# Altium project iceWerx_dev_carrier.PrjPcb
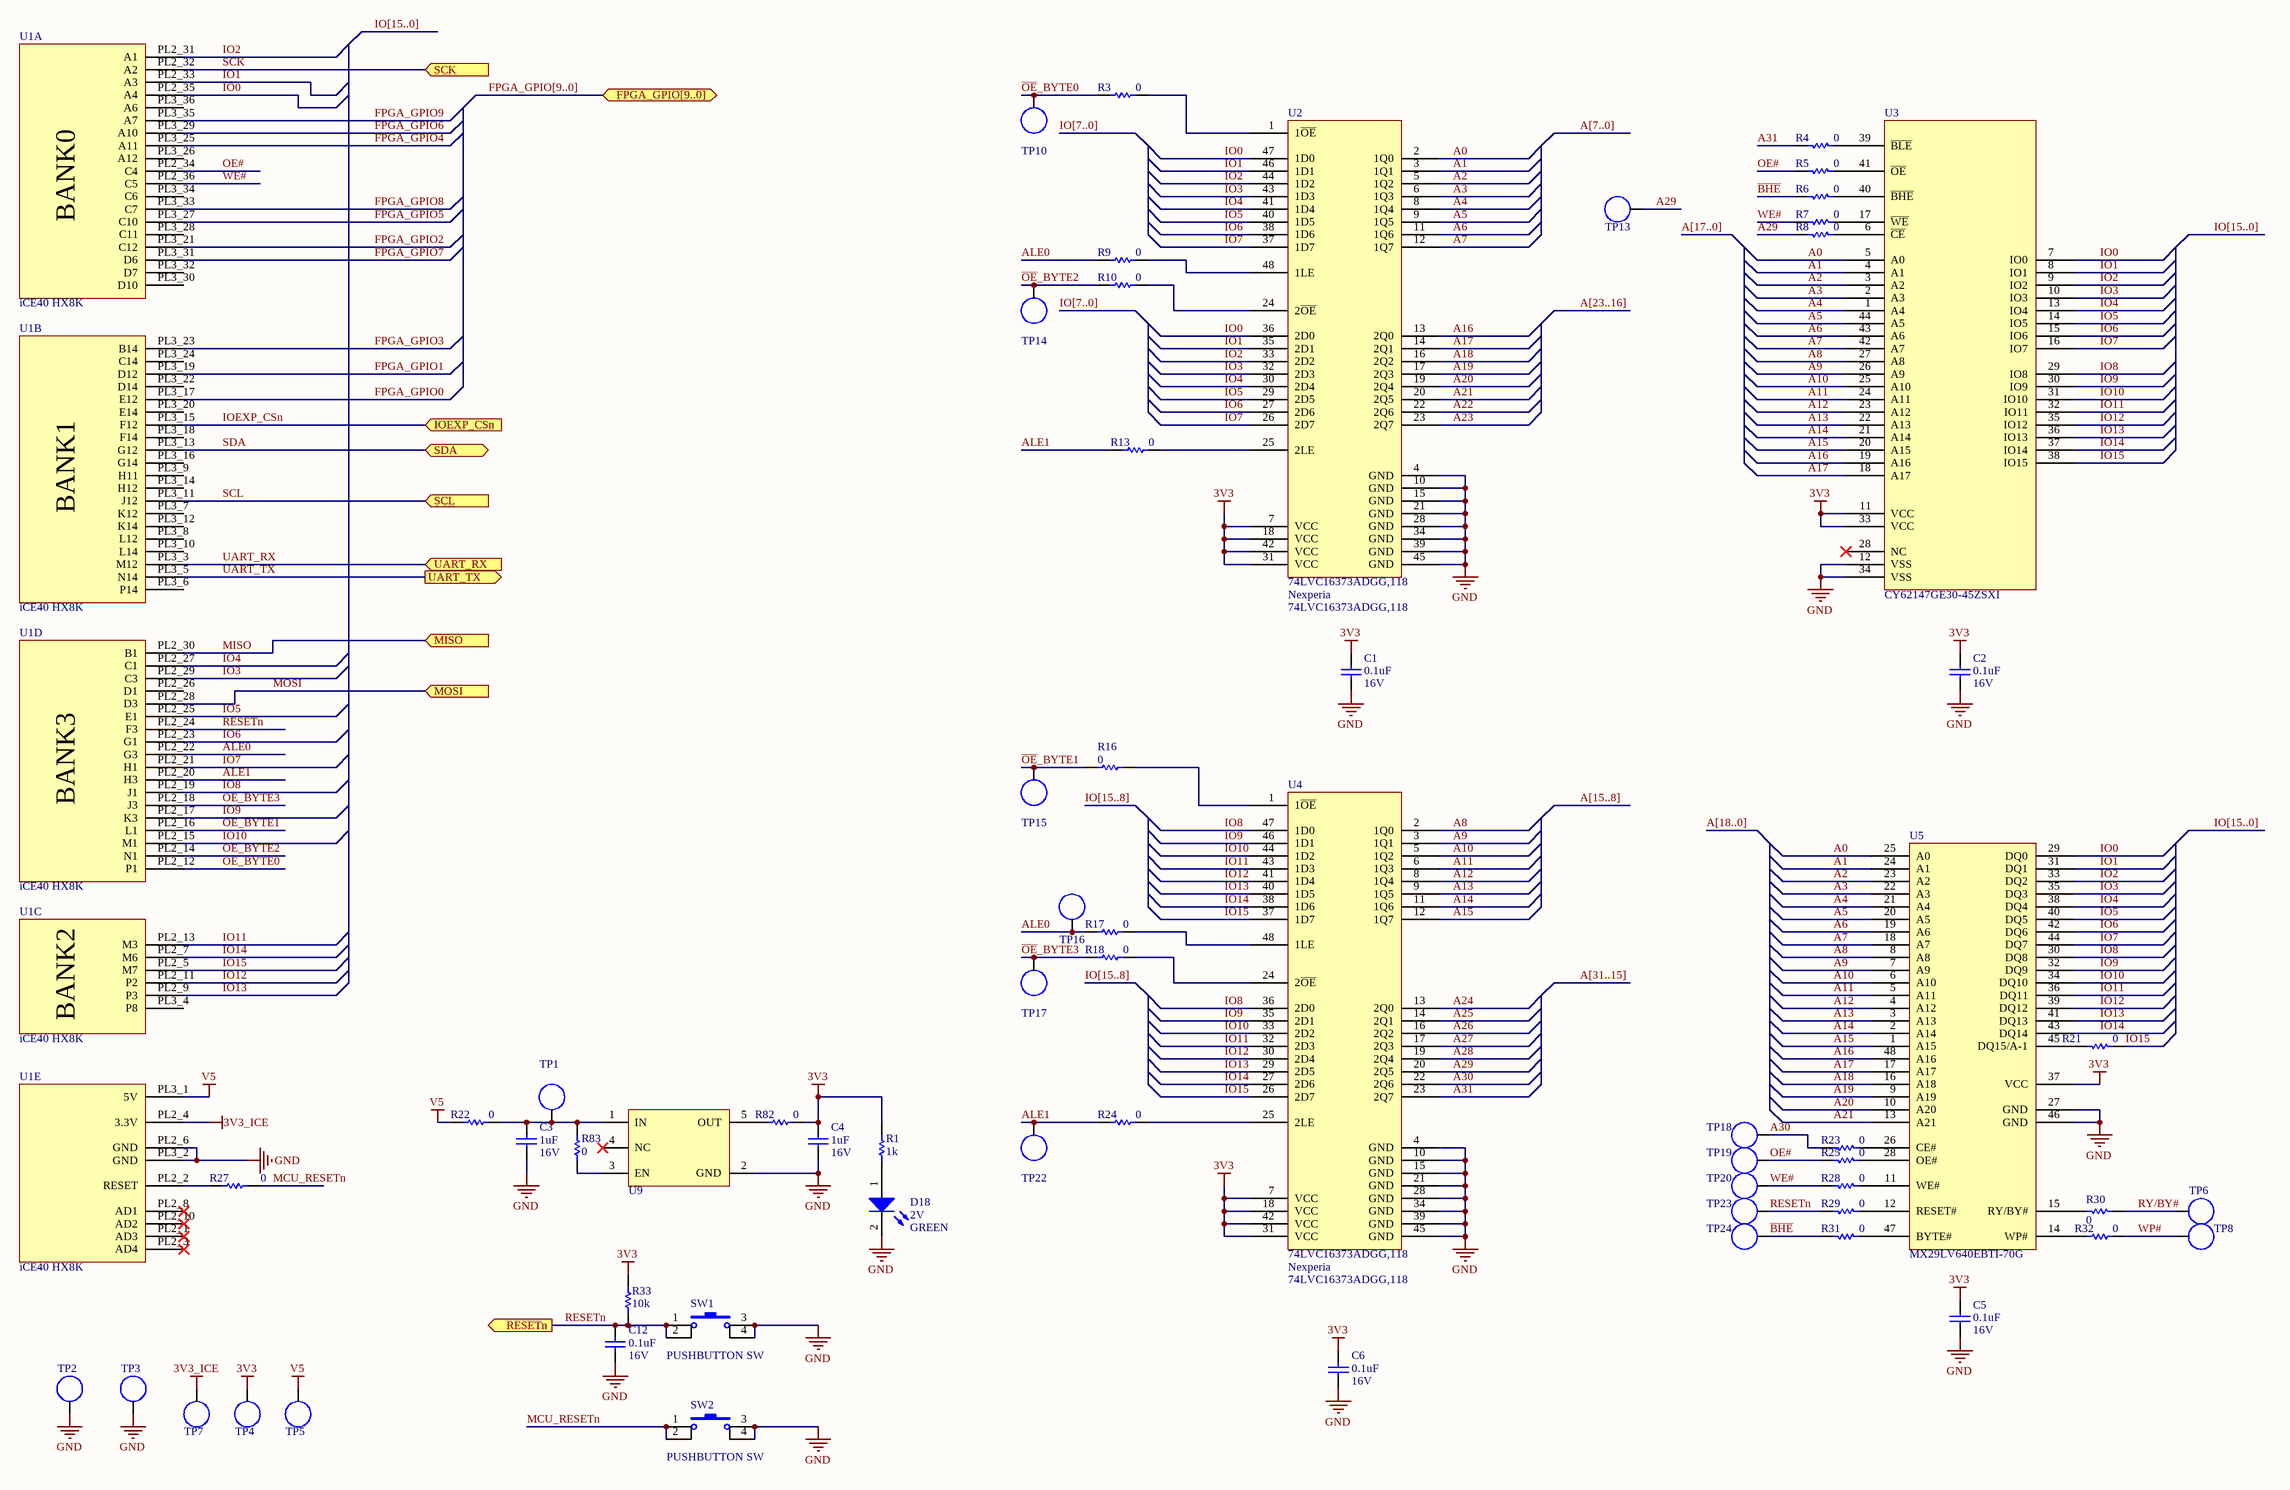
[diagram p0: icewerks.SchDoc]
2 sheets, 142 parts. Net scope: flat (ports and power ports of the same name join across sheets).
Board file: iceWerx_dev_carrier.PcbDoc
Sheets:
  icewerks.SchDoc
  peripherals.SchDoc

## Sheet icewerks.SchDoc
size C

### Parts
C1  Voltage: 16V  Capacitance: 0.1uF  [0805]  (hidden comment: Cap_NP)
C2  Voltage: 16V  Capacitance: 0.1uF  [0805]  (hidden comment: Cap_NP)
C3  Voltage: 16V  Capacitance: 1uF  [0805]  (hidden comment: Cap_NP)
C4  Voltage: 16V  Capacitance: 1uF  [0805]  (hidden comment: Cap_NP)
C5  Voltage: 16V  Capacitance: 0.1uF  [0805]  (hidden comment: Cap_NP)
C6  Voltage: 16V  Capacitance: 0.1uF  [0805]  (hidden comment: Cap_NP)
C12  Voltage: 16V  Capacitance: 0.1uF  [0805]  (hidden comment: Cap_NP)
D18  Vf: 2V  Color: GREEN  [HSMG-C170]  (hidden comment: LED)
R1  Resistance: 1k  [0805]  (hidden comment: Res)
R3  Resistance: 0  [0805]  (hidden comment: Res)
R4  Resistance: 0  [0805]  (hidden comment: Res)
R5  Resistance: 0  [0805]  (hidden comment: Res)
R6  Resistance: 0  [0805]  (hidden comment: Res)
R7  Resistance: 0  [0805]  (hidden comment: Res)
R8  Resistance: 0  [0805]  (hidden comment: Res)
R9  Resistance: 0  [0805]  (hidden comment: Res)
R10  Resistance: 0  [0805]  (hidden comment: Res)
R13  Resistance: 0  [0805]  (hidden comment: Res)
R16  Resistance: 0  [0805]  (hidden comment: Res)
R17  Resistance: 0  [0805]  (hidden comment: Res)
R18  Resistance: 0  [0805]  (hidden comment: Res)
R21  Resistance: 0  [0805]  (hidden comment: Res)
R22  Resistance: 0  [0805]  (hidden comment: Res)
R23  Resistance: 0  [0805]  (hidden comment: Res)
R24  Resistance: 0  [0805]  (hidden comment: Res)
R25  Resistance: 0  [0805]  (hidden comment: Res)
R27  Resistance: 0  [0805]  (hidden comment: Res)
R28  Resistance: 0  [0805]  (hidden comment: Res)
R29  Resistance: 0  [0805]  (hidden comment: Res)
R30  Resistance: 0  [0805]  (hidden comment: Res)
R31  Resistance: 0  [0805]  (hidden comment: Res)
R32  Resistance: 0  [0805]  (hidden comment: Res)
R33  Resistance: 10k  [0805]  (hidden comment: Res)
R82  Resistance: 0  [0805]  (hidden comment: Res)
R83  Resistance: 0  [0805]  (hidden comment: Res)
SW1  PUSHBUTTON SW  [XKB TS-1187A]
SW2  PUSHBUTTON SW  [XKB TS-1187A]
TP1  TP  [KEYSTONE_5012]  (value not drawn)
TP2  TP  [KEYSTONE_5012]  (value not drawn)
TP3  TP  [KEYSTONE_5012]  (value not drawn)
TP4  TP  [KEYSTONE_5012]  (value not drawn)
TP5  TP  [KEYSTONE_5012]  (value not drawn)
TP6  TP  [KEYSTONE_5012]  (value not drawn)
TP7  TP  [KEYSTONE_5012]  (value not drawn)
TP8  TP  [KEYSTONE_5012]  (value not drawn)
TP10  TP  [KEYSTONE_5012]  (value not drawn)
TP13  TP  [KEYSTONE_5012]  (value not drawn)
TP14  TP  [KEYSTONE_5012]  (value not drawn)
TP15  TP  [KEYSTONE_5012]  (value not drawn)
TP16  TP  [KEYSTONE_5012]  (value not drawn)
TP17  TP  [KEYSTONE_5012]  (value not drawn)
TP18  TP  [KEYSTONE_5012]  (value not drawn)
TP19  TP  [KEYSTONE_5012]  (value not drawn)
TP20  TP  [KEYSTONE_5012]  (value not drawn)
TP22  TP  [KEYSTONE_5012]  (value not drawn)
TP23  TP  [KEYSTONE_5012]  (value not drawn)
TP24  TP  [KEYSTONE_5012]  (value not drawn)
U1  iCE40 HX8K  [iCE40 HX8K FPGA MODULE]  (parts A,B,C,D,E of 5)
U2  74LVC16373ADGG,118  Manufacturer: Nexperia  [NEXPERIA TSSOP-48 (SOT362-1)]
U3  CY62147GE30-45ZSXI  [CYPRESS Z44 44-TSOP II]
U4  74LVC16373ADGG,118  Manufacturer: Nexperia  [NEXPERIA TSSOP-48 (SOT362-1)]
U5  MX29LV640EBTI-70G
U9  TLV73333PDBVR  [TI DBV0005A (SOT23-5)]  (value not drawn)

### Ports
FPGA_GPIO[9..0] (bidir), IOEXP_CSn (in), MISO (in), MOSI (in), RESETn (out), SCK (in), SCL (in), SDA (bidir), UART_RX (in), UART_TX (out)

### Nets
3V3: C1.2 C2.2 C4.2 C5.2 C6.2 R1.2 R33.2 R82.2 TP4.1 U2.7(VCC) U2.18(VCC) U2.31(VCC) U2.42(VCC) U3.11(VCC) U3.33(VCC) U4.7(VCC) U4.18(VCC) U4.31(VCC) U4.42(VCC) U5.37(VCC)
3V3_ICE: TP7.1 U1.PL2_4(3.3V)
GND: C1.1 C2.1 C3.1 C4.1 C5.1 C6.1 C12.1 D18.2(K) SW1.3 SW1.4 SW2.3 SW2.4 TP2.1 TP3.1 U1.PL2_6(GND) U1.PL3_2(GND) U2.4(GND) U2.10(GND) U2.15(GND) U2.21(GND) U2.28(GND) U2.34(GND) U2.39(GND) U2.45(GND) U3.12(VSS) U3.34(VSS) U4.4(GND) U4.10(GND) U4.15(GND) U4.21(GND) U4.28(GND) U4.34(GND) U4.39(GND) U4.45(GND) U5.27(GND) U5.46(GND) U9.2(GND)
V5: R22.1 TP5.1 U1.PL3_1(5V)
A0: U2.2(1Q0) U3.5(A0) U5.25(A0)
A1: U2.3(1Q1) U3.4(A1) U5.24(A1)
A2: U2.5(1Q2) U3.3(A2) U5.23(A2)
A3: U2.6(1Q3) U3.2(A3) U5.22(A3)
A4: U2.8(1Q4) U3.1(A4) U5.21(A4)
A5: U2.9(1Q5) U3.44(A5) U5.20(A5)
A6: U2.11(1Q6) U3.43(A6) U5.19(A6)
A7: U2.12(1Q7) U3.42(A7) U5.18(A7)
A8: U3.27(A8) U4.2(1Q0) U5.8(A8)
A9: U3.26(A9) U4.3(1Q1) U5.7(A9)
A10: U3.25(A10) U4.5(1Q2) U5.6(A10)
A11: U3.24(A11) U4.6(1Q3) U5.5(A11)
A12: U3.23(A12) U4.8(1Q4) U5.4(A12)
A13: U3.22(A13) U4.9(1Q5) U5.3(A13)
A14: U3.21(A14) U4.11(1Q6) U5.2(A14)
A15: U3.20(A15) U4.12(1Q7) U5.1(A15)
A16: U2.13(2Q0) U3.19(A16) U5.48(A16)
A17: U2.14(2Q1) U3.18(A17) U5.17(A17)
A18: U2.16(2Q2) U5.16(A18)
A19: U2.17(2Q3) U5.9(A19)
A20: U2.19(2Q4) U5.10(A20)
A21: U2.20(2Q5) U5.13(A21)
A22: U2.22(2Q6)
A23: U2.23(2Q7)
A24: U4.13(2Q0)
A25: U4.14(2Q1)
A26: U4.16(2Q2)
A27: U4.17(2Q3)
A28: U4.19(2Q4)
A29: R8.2 TP13.1 U4.20(2Q5)
A30: R23.2 TP18.1 U4.22(2Q6)
A31: R4.2 U4.23(2Q7)
ALE0: R9.1 R17.1 TP16.1 U1.PL2_22(G3)
ALE1: R13.1 R24.1 TP22.1 U1.PL2_20(H3)
~{BHE}: R6.2 R31.2 TP24.1
FPGA_GPIO0: U1.PL3_17(E12)
FPGA_GPIO1: U1.PL3_19(D12)
FPGA_GPIO2: U1.PL3_21(C12)
FPGA_GPIO3: U1.PL3_23(B14)
FPGA_GPIO4: U1.PL3_25(A11)
FPGA_GPIO5: U1.PL3_27(C10)
FPGA_GPIO6: U1.PL3_29(A10)
FPGA_GPIO7: U1.PL3_31(D6)
FPGA_GPIO8: U1.PL3_33(C7)
FPGA_GPIO9: U1.PL3_35(A7)
IO0: U1.PL2_35(A4) U2.36(2D0) U2.47(1D0) U3.7(IO0) U5.29(DQ0)
IO1: U1.PL2_33(A3) U2.35(2D1) U2.46(1D1) U3.8(IO1) U5.31(DQ1)
IO2: U1.PL2_31(A1) U2.33(2D2) U2.44(1D2) U3.9(IO2) U5.33(DQ2)
IO3: U1.PL2_29(C3) U2.32(2D3) U2.43(1D3) U3.10(IO3) U5.35(DQ3)
IO4: U1.PL2_27(C1) U2.30(2D4) U2.41(1D4) U3.13(IO4) U5.38(DQ4)
IO5: U1.PL2_25(E1) U2.29(2D5) U2.40(1D5) U3.14(IO5) U5.40(DQ5)
IO6: U1.PL2_23(G1) U2.27(2D6) U2.38(1D6) U3.15(IO6) U5.42(DQ6)
IO7: U1.PL2_21(H1) U2.26(2D7) U2.37(1D7) U3.16(IO7) U5.44(DQ7)
IO8: U1.PL2_19(J1) U3.29(IO8) U4.36(2D0) U4.47(1D0) U5.30(DQ8)
IO9: U1.PL2_17(K3) U3.30(IO9) U4.35(2D1) U4.46(1D1) U5.32(DQ9)
IO10: U1.PL2_15(M1) U3.31(IO10) U4.33(2D2) U4.44(1D2) U5.34(DQ10)
IO11: U1.PL2_13(M3) U3.32(IO11) U4.32(2D3) U4.43(1D3) U5.36(DQ11)
IO12: U1.PL2_11(P2) U3.35(IO12) U4.30(2D4) U4.41(1D4) U5.39(DQ12)
IO13: U1.PL2_9(P3) U3.36(IO13) U4.29(2D5) U4.40(1D5) U5.41(DQ13)
IO14: U1.PL2_7(M6) U3.37(IO14) U4.27(2D6) U4.38(1D6) U5.43(DQ14)
IO15: R21.1 U1.PL2_5(M7) U3.38(IO15) U4.26(2D7) U4.37(1D7)
IOEXP_CSn: U1.PL3_15(F12) ; port IOEXP_CSn
MCU_RESETn: R27.2 SW2.1 SW2.2
MISO: U1.PL2_30(B1) ; port MISO
MOSI: U1.PL2_28(D3) ; port MOSI
~{OE}_BYTE0: R3.1 TP10.1 U1.PL2_12(P1)
~{OE}_BYTE1: R16.1 TP15.1 U1.PL2_16(L1)
~{OE}_BYTE2: R10.1 TP14.1 U1.PL2_14(N1)
~{OE}_BYTE3: R18.1 TP17.1 U1.PL2_18(J3)
OE#: R5.2 R25.2 TP19.1 U1.PL2_34(C4)
RESETn: C12.2 R29.2 R33.1 SW1.1 SW1.2 TP23.1 U1.PL2_24(F3) ; port RESETn
RY/BY#: R30.1 TP6.1
SCK: U1.PL2_32(A2) ; port SCK
SCL: U1.PL3_11(J12) ; port SCL
SDA: U1.PL3_13(G12) ; port SDA
UART_RX: U1.PL3_3(M12) ; port UART_RX
UART_TX: U1.PL3_5(N14) ; port UART_TX
WE#: R7.2 R28.2 TP20.1 U1.PL2_36(C5)
WP#: R32.2 TP8.1
NetC3_2: C3.2 R22.2 R83.2 TP1.1 U9.1(IN)
NetD18_1: D18.1(A) R1.1
NetR3_2: R3.2 U2.1(1~{OE})
NetR4_1: R4.1 U3.39(~{BLE})
NetR5_1: R5.1 U3.41(~{OE})
NetR6_1: R6.1 U3.40(~{BHE})
NetR7_1: R7.1 U3.17(~{WE})
NetR8_1: R8.1 U3.6(~{CE})
NetR9_2: R9.2 U2.48(1LE)
NetR10_2: R10.2 U2.24(2~{OE})
NetR13_2: R13.2 U2.25(2LE)
NetR16_2: R16.2 U4.1(1~{OE})
NetR17_2: R17.2 U4.48(1LE)
NetR18_2: R18.2 U4.24(2~{OE})
NetR21_2: R21.2 U5.45(DQ15/A-1)
NetR23_1: R23.1 U5.26(CE#)
NetR24_2: R24.2 U4.25(2LE)
NetR25_1: R25.1 U5.28(OE#)
NetR27_1: R27.1 U1.PL2_2(RESET)
NetR28_1: R28.1 U5.11(WE#)
NetR29_1: R29.1 U5.12(RESET#)
NetR30_2: R30.2 U5.15(RY/BY#)
NetR31_1: R31.1 U5.47(BYTE#)
NetR32_1: R32.1 U5.14(WP#)
NetR82_1: R82.1 U9.5(OUT)
NetR83_1: R83.1 U9.3(EN)

Not connected (* = marked no-connect by the designer): U1 PL2_1(AD3)* PL2_3(AD4)* PL2_8(AD1)* PL2_10(AD2)* PL2_26(D1) PL3_4(P8) PL3_6(P14) PL3_7(K12) PL3_8(L12) PL3_9(H11) PL3_10(L14) PL3_12(K14) PL3_14(H12) PL3_16(G14) PL3_18(F14) PL3_20(E14) PL3_22(D14) PL3_24(C14) PL3_26(A12) PL3_28(C11) PL3_30(D10) PL3_32(D7) PL3_34(C6) PL3_36(A6); U3 28(NC)*; U9 4(NC)*

### Buses and harness runs
bus A[7..0]
bus A[15..8]
bus A[17..0]
bus A[18..0]
bus A[23..16]
bus A[31..15]
bus FPGA_GPIO[9..0] = port FPGA_GPIO[9..0]
bus IO[7..0]
bus IO[15..0]
bus IO[15..8]

### Notes on the sheet
- (in symbol iCE40 HX8K FPGA MODULE, part A) BANK0
- (in symbol iCE40 HX8K FPGA MODULE, part B) BANK1
- (in symbol iCE40 HX8K FPGA MODULE, part C) BANK2
- (in symbol iCE40 HX8K FPGA MODULE, part D) BANK3

### Library data of the parts
C1 C2 C5 C6 C12 = Cap_NP: Capacitor; Manufacturer PN: C0805C104M4VACTU; Manufacturer: KEMET; Tolerance: *
C3 C4 = Cap_NP: Capacitor; Manufacturer PN: EMK212BJ105MD-T; Manufacturer: Taiyo Yuden; Tolerance: *
D18 = LED: Manufacturer: Broadcom; Manufacturer PN: HSMG-C170
R1 = Res: Resistor; Manufacturer PN: RMCF0805JT1K00; Manufacturer: Stackpole Electronics Inc; Tolerance: 5%; Power Rating: 1/8W
R3-R10 R13 R16-R18 R21-R25 R27-R32 R82 R83 = Res: Resistor; Manufacturer PN: RMCF0805ZT0R00; Manufacturer: Stackpole Electronics Inc; Tolerance: Jumper; Power Rating: 1/10W
R33 = Res: Resistor; Manufacturer PN: RMCF0805JT10K0; Manufacturer: Stackpole Electronics Inc; Tolerance: 5%; Power Rating: 1/8W
SW1 SW2 = SWITCH_PB: Manufacturer PN: TS-1187A-C-E-B; Manufacturer: XKB
TP1-TP8 TP10 TP13-TP20 TP22-TP24 = TP: Manufacturer PN: 5015; Manufacturer: Keystone
U1 = iCE40 HX8K FPGA MODULE: Manufacturer: Samtec; Manufacturer PN: SQW-118-01-L-D
U2 U4 = 74LVC16373ADGG,118: D-Type Transparent Latch 2 Channel 8:8 IC Tri-State 48-TSSOP; Manufacturer PN: 74LVC16373ADGG,118
U3 = CY62147GE30-45ZSXI: SRAM - Asynchronous Memory IC 4Mb (256K x 16) Parallel 45ns 44-TSOP II; Manufacturer: Cypress; Manufacturer PN: CY62147GE30-45ZSXI
U5 = MX29LV640EBTI-70G: FLASH - NOR Memory IC 8Mb (1M x 8, 512K x 16) Parallel  70ns 48-TSOP; Manufacturer: Macronix; Manufacturer PN: MX29LV640EBTI-70G
U9 = TLV73333PDBVR: Manufacturer: Texas Instruments; Manufacturer PN: TLV73333PDBVR

## Sheet peripherals.SchDoc
size C
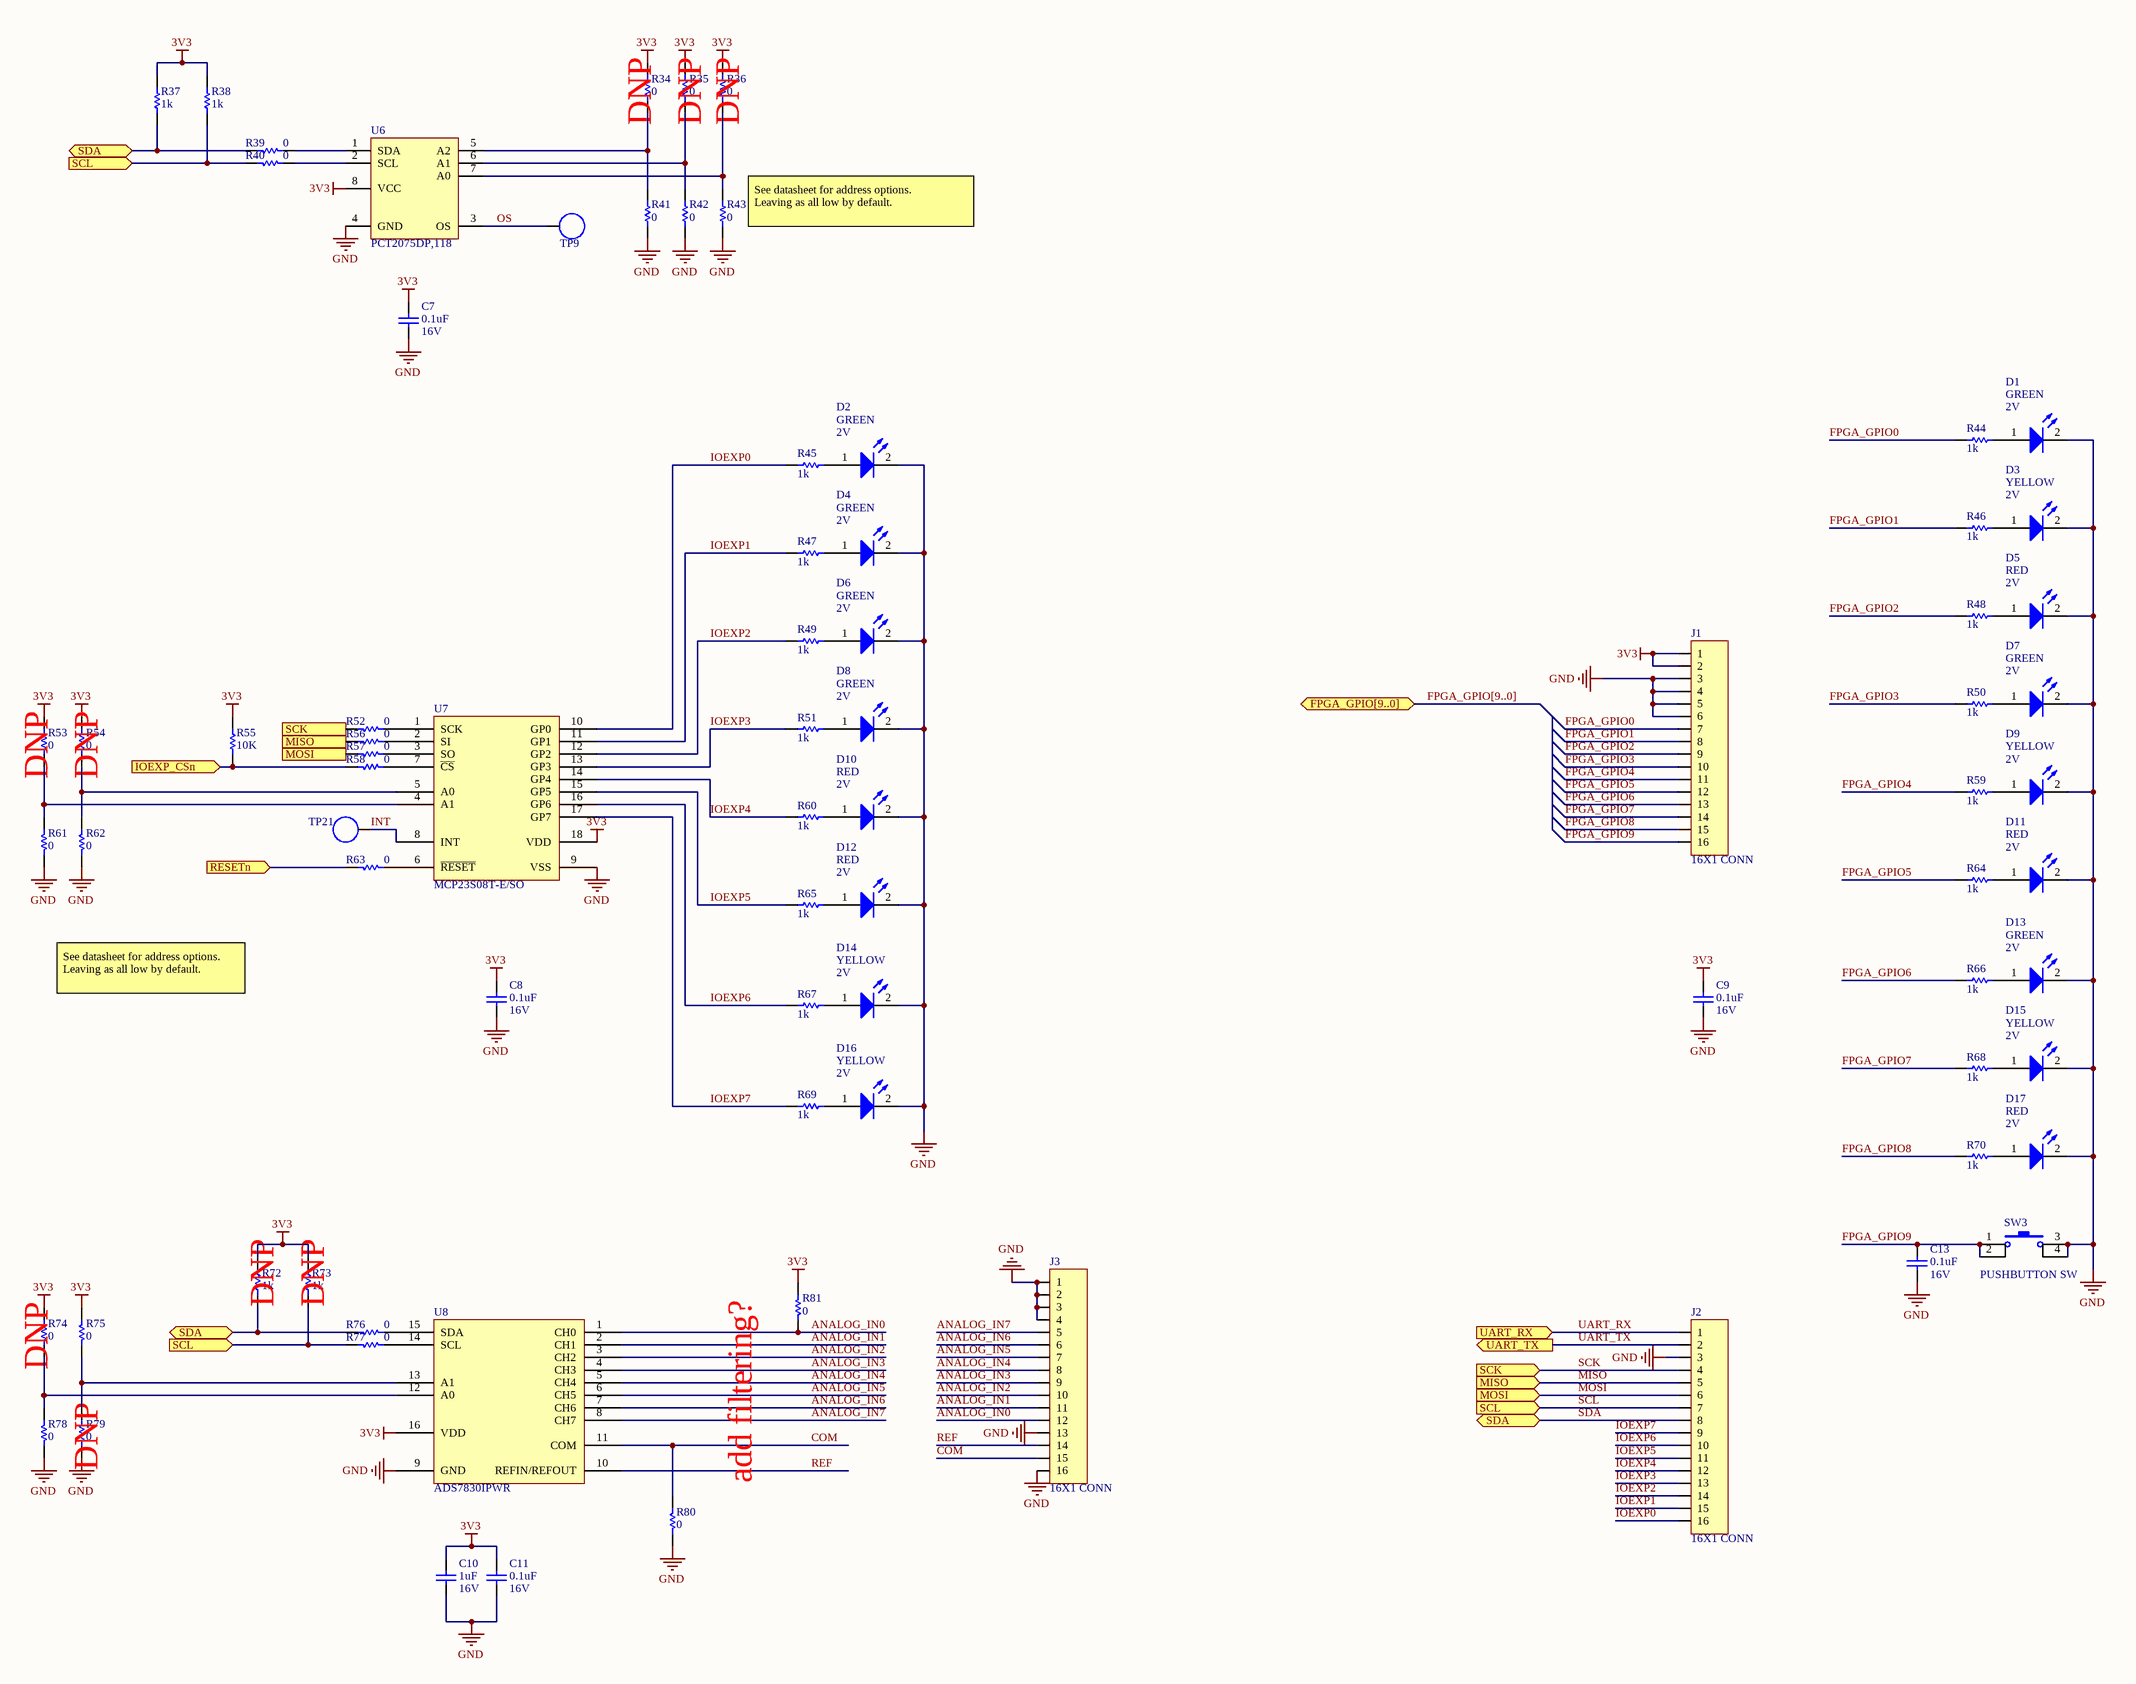
[diagram p1: peripherals.SchDoc]

### Parts
C7  Voltage: 16V  Capacitance: 0.1uF  [0805]  (hidden comment: Cap_NP)
C8  Voltage: 16V  Capacitance: 0.1uF  [0805]  (hidden comment: Cap_NP)
C9  Voltage: 16V  Capacitance: 0.1uF  [0805]  (hidden comment: Cap_NP)
C10  Voltage: 16V  Capacitance: 1uF  [0805]  (hidden comment: Cap_NP)
C11  Voltage: 16V  Capacitance: 0.1uF  [0805]  (hidden comment: Cap_NP)
C13  Voltage: 16V  Capacitance: 0.1uF  [0805]  (hidden comment: Cap_NP)
D1  Vf: 2V  Color: GREEN  [HSMG-C170]  (hidden comment: LED)
D2  Vf: 2V  Color: GREEN  [HSMG-C170]  (hidden comment: LED)
D3  Vf: 2V  Color: YELLOW  [HSMG-C170]  (hidden comment: LED)
D4  Vf: 2V  Color: GREEN  [HSMG-C170]  (hidden comment: LED)
D5  Vf: 2V  Color: RED  [HSMG-C170]  (hidden comment: LED)
D6  Vf: 2V  Color: GREEN  [HSMG-C170]  (hidden comment: LED)
D7  Vf: 2V  Color: GREEN  [HSMG-C170]  (hidden comment: LED)
D8  Vf: 2V  Color: GREEN  [HSMG-C170]  (hidden comment: LED)
D9  Vf: 2V  Color: YELLOW  [HSMG-C170]  (hidden comment: LED)
D10  Vf: 2V  Color: RED  [HSMG-C170]  (hidden comment: LED)
D11  Vf: 2V  Color: RED  [HSMG-C170]  (hidden comment: LED)
D12  Vf: 2V  Color: RED  [HSMG-C170]  (hidden comment: LED)
D13  Vf: 2V  Color: GREEN  [HSMG-C170]  (hidden comment: LED)
D14  Vf: 2V  Color: YELLOW  [HSMG-C170]  (hidden comment: LED)
D15  Vf: 2V  Color: YELLOW  [HSMG-C170]  (hidden comment: LED)
D16  Vf: 2V  Color: YELLOW  [HSMG-C170]  (hidden comment: LED)
D17  Vf: 2V  Color: RED  [HSMG-C170]  (hidden comment: LED)
J1  16X1 CONN  [0.100 16X1 HEADER]
J2  16X1 CONN  [0.100 16X1 HEADER]
J3  16X1 CONN  [0.100 16X1 HEADER]
R34  Resistance: 0  [0805]  (hidden comment: Res)
R35  Resistance: 0  [0805]  (hidden comment: Res)
R36  Resistance: 0  [0805]  (hidden comment: Res)
R37  Resistance: 1k  [0805]  (hidden comment: Res)
R38  Resistance: 1k  [0805]  (hidden comment: Res)
R39  Resistance: 0  [0805]  (hidden comment: Res)
R40  Resistance: 0  [0805]  (hidden comment: Res)
R41  Resistance: 0  [0805]  (hidden comment: Res)
R42  Resistance: 0  [0805]  (hidden comment: Res)
R43  Resistance: 0  [0805]  (hidden comment: Res)
R44  Resistance: 1k  [0805]  (hidden comment: Res)
R45  Resistance: 1k  [0805]  (hidden comment: Res)
R46  Resistance: 1k  [0805]  (hidden comment: Res)
R47  Resistance: 1k  [0805]  (hidden comment: Res)
R48  Resistance: 1k  [0805]  (hidden comment: Res)
R49  Resistance: 1k  [0805]  (hidden comment: Res)
R50  Resistance: 1k  [0805]  (hidden comment: Res)
R51  Resistance: 1k  [0805]  (hidden comment: Res)
R52  Resistance: 0  [0805]  (hidden comment: Res)
R53  Resistance: 0  [0805]  (hidden comment: Res)
R54  Resistance: 0  [0805]  (hidden comment: Res)
R55  Resistance: 10K  [0805]  (hidden comment: Res)
R56  Resistance: 0  [0805]  (hidden comment: Res)
R57  Resistance: 0  [0805]  (hidden comment: Res)
R58  Resistance: 0  [0805]  (hidden comment: Res)
R59  Resistance: 1k  [0805]  (hidden comment: Res)
R60  Resistance: 1k  [0805]  (hidden comment: Res)
R61  Resistance: 0  [0805]  (hidden comment: Res)
R62  Resistance: 0  [0805]  (hidden comment: Res)
R63  Resistance: 0  [0805]  (hidden comment: Res)
R64  Resistance: 1k  [0805]  (hidden comment: Res)
R65  Resistance: 1k  [0805]  (hidden comment: Res)
R66  Resistance: 1k  [0805]  (hidden comment: Res)
R67  Resistance: 1k  [0805]  (hidden comment: Res)
R68  Resistance: 1k  [0805]  (hidden comment: Res)
R69  Resistance: 1k  [0805]  (hidden comment: Res)
R70  Resistance: 1k  [0805]  (hidden comment: Res)
R72  Resistance: 1k  [0805]  (hidden comment: Res)
R73  Resistance: 1k  [0805]  (hidden comment: Res)
R74  Resistance: 0  [0805]  (hidden comment: Res)
R75  Resistance: 0  [0805]  (hidden comment: Res)
R76  Resistance: 0  [0805]  (hidden comment: Res)
R77  Resistance: 0  [0805]  (hidden comment: Res)
R78  Resistance: 0  [0805]  (hidden comment: Res)
R79  Resistance: 0  [0805]  (hidden comment: Res)
R80  Resistance: 0  [0805]  (hidden comment: Res)
R81  Resistance: 0  [0805]  (hidden comment: Res)
SW3  PUSHBUTTON SW  [XKB TS-1187A]
TP9  TP  [KEYSTONE_5012]  (value not drawn)
TP21  TP  [KEYSTONE_5012]  (value not drawn)
U6  PCT2075DP,118  [NXP TSSOP-8 (SOT505-1)]
U7  MCP23S08T-E/SO  [MICROCHIP 18-SOIC]
U8  ADS7830IPWR  [TI PW0016A (16TSSOP)]

### Ports
FPGA_GPIO[9..0] (bidir), IOEXP_CSn (in), MISO (in), MOSI (in), RESETn (in), SCK (in), SCL (in), SDA (bidir), UART_RX (in), UART_TX (out)

### Nets
3V3: C7.2 C8.2 C9.2 C10.2 C11.2 J1.1 J1.2 R34.1 R35.1 R36.1 R37.1 R38.1 R53.1 R54.1 R55.1 R72.1 R73.1 R74.1 R75.1 R81.1 U6.8(VCC) U7.18(VDD) U8.16(VDD)
GND: C7.1 C8.1 C9.1 C10.1 C11.1 C13.1 D1.2(K) D2.2(K) D3.2(K) D4.2(K) D5.2(K) D6.2(K) D7.2(K) D8.2(K) D9.2(K) D10.2(K) D11.2(K) D12.2(K) D13.2(K) D14.2(K) D15.2(K) D16.2(K) D17.2(K) J1.3 J1.4 J1.5 J1.6 J2.3 J3.1 J3.2 J3.3 J3.4 J3.13 J3.16 R41.2 R42.2 R43.2 R61.2 R62.2 R78.2 R79.2 R80.2 SW3.3 SW3.4 U6.4(GND) U7.9(VSS) U8.9(GND)
ANALOG_IN0: J3.12 R81.2 U8.1(CH0)
ANALOG_IN1: J3.11 U8.2(CH1)
ANALOG_IN2: J3.10 U8.3(CH2)
ANALOG_IN3: J3.9 U8.4(CH3)
ANALOG_IN4: J3.8 U8.5(CH4)
ANALOG_IN5: J3.7 U8.6(CH5)
ANALOG_IN6: J3.6 U8.7(CH6)
ANALOG_IN7: J3.5 U8.8(CH7)
COM: J3.15 R80.1 U8.11(COM)
FPGA_GPIO0: J1.7 R44.2
FPGA_GPIO1: J1.8 R46.2
FPGA_GPIO2: J1.9 R48.2
FPGA_GPIO3: J1.10 R50.2
FPGA_GPIO4: J1.11 R59.2
FPGA_GPIO5: J1.12 R64.2
FPGA_GPIO6: J1.13 R66.2
FPGA_GPIO7: J1.14 R68.2
FPGA_GPIO8: J1.15 R70.2
FPGA_GPIO9: C13.2 J1.16 SW3.1 SW3.2
INT: TP21.1 U7.8(INT)
IOEXP0: J2.16 R45.2 U7.10(GP0)
IOEXP1: J2.15 R47.2 U7.11(GP1)
IOEXP2: J2.14 R49.2 U7.12(GP2)
IOEXP3: J2.13 R51.2 U7.13(GP3)
IOEXP4: J2.12 R60.2 U7.14(GP4)
IOEXP5: J2.11 R65.2 U7.15(GP5)
IOEXP6: J2.10 R67.2 U7.16(GP6)
IOEXP7: J2.9 R69.2 U7.17(GP7)
IOEXP_CSn: R55.2 R58.2 ; port IOEXP_CSn
MISO: J2.5 R56.2 ; port MISO
MOSI: J2.6 R57.2 ; port MOSI
OS: TP9.1 U6.3(OS)
REF: J3.14 U8.10(REFIN/REFOUT)
RESETn: R63.2 ; port RESETn
SCK: J2.4 R52.2 ; port SCK
SCL: J2.7 R38.2 R40.2 R73.2 R77.2 ; port SCL
SDA: J2.8 R37.2 R39.2 R72.2 R76.2 ; port SDA
UART_RX: J2.1 ; port UART_RX
UART_TX: J2.2 ; port UART_TX
NetD1_1: D1.1(A) R44.1
NetD2_1: D2.1(A) R45.1
NetD3_1: D3.1(A) R46.1
NetD4_1: D4.1(A) R47.1
NetD5_1: D5.1(A) R48.1
NetD6_1: D6.1(A) R49.1
NetD7_1: D7.1(A) R50.1
NetD8_1: D8.1(A) R51.1
NetD9_1: D9.1(A) R59.1
NetD10_1: D10.1(A) R60.1
NetD11_1: D11.1(A) R64.1
NetD12_1: D12.1(A) R65.1
NetD13_1: D13.1(A) R66.1
NetD14_1: D14.1(A) R67.1
NetD15_1: D15.1(A) R68.1
NetD16_1: D16.1(A) R69.1
NetD17_1: D17.1(A) R70.1
NetR34_2: R34.2 R41.1 U6.5(A2)
NetR35_2: R35.2 R42.1 U6.6(A1)
NetR36_2: R36.2 R43.1 U6.7(A0)
NetR39_1: R39.1 U6.1(SDA)
NetR40_1: R40.1 U6.2(SCL)
NetR52_1: R52.1 U7.1(SCK)
NetR53_2: R53.2 R61.1 U7.4(A1)
NetR54_2: R54.2 R62.1 U7.5(A0)
NetR56_1: R56.1 U7.2(SI)
NetR57_1: R57.1 U7.3(SO)
NetR58_1: R58.1 U7.7(~{CS})
NetR63_1: R63.1 U7.6(~{RESET})
NetR74_2: R74.2 R78.1 U8.12(A0)
NetR75_2: R75.2 R79.1 U8.13(A1)
NetR76_1: R76.1 U8.15(SDA)
NetR77_1: R77.1 U8.14(SCL)

### Buses and harness runs
bus FPGA_GPIO[9..0] = port FPGA_GPIO[9..0]

### Notes on the sheet
- (near R34) DNP
- (near R35) DNP
- (near R36) DNP
- (near R43) See datasheet for address options.
  Leaving as all low by default.
- (near R53) DNP
- (near R54) DNP
- See datasheet for address options.
  Leaving as all low by default.
- (near R72) DNP
- (near R73) DNP
- (near R74) DNP
- (near R79) DNP
- add filtering?
- PCBA Name
- PCBA REV
- PCB Engineer
- Sheet Name
- 140 Center St., El Segundo, CA 90245
- SECOND ORDER EFFECTS
- www.soeffects.com
- PCBA Part Number
- Review Ticket ID
- Project
- Sheet Number
- /

### Library data of the parts
C7-C9 C11 C13 = Cap_NP: as C1 on sheet icewerks; Tolerance: *
C10 = Cap_NP: as C3 on sheet icewerks; Tolerance: *
D1-D17 = LED: Manufacturer: Broadcom; Manufacturer PN: HSMG-C170
J1-J3 = 16X1 CONN: Manufacturer PN: PPTC161LFBN-RC; Manufacturer: Sullins
R34-R36 R39-R43 R52-R54 R56-R58 R61-R63 R74-R81 = Res: as R3 on sheet icewerks
R37 R38 R44-R51 R59 R60 R64-R70 R72 R73 = Res: as R1 on sheet icewerks
R55 = Res: as R33 on sheet icewerks
SW3 = SWITCH_PB: as SW1 on sheet icewerks
TP9 TP21 = TP: as TP1 on sheet icewerks
U6 = PCT2075DP,118: Temperature Sensor Digital, Local -55°C ~ 125°C 11 b 8-TSSOP; Manufacturer: NXP; Manufacturer PN: PCT2075DP,118
U7 = MCP23S08T-E/SO: Manufacturer: Microchip; Manufacturer PN: MCP23S08T-E/SO
U8 = ADS7830IPWR: Manufacturer: Texas Instruments; Manufacturer PN: ADS7830IPWR

## Nets that join several sheets
3V3: icewerks (20 pins), peripherals (23 pins)
GND: icewerks (37 pins), peripherals (47 pins)
FPGA_GPIO0: icewerks (U1.PL3_17), peripherals (J1.7 R44.2)
FPGA_GPIO1: icewerks (U1.PL3_19), peripherals (J1.8 R46.2)
FPGA_GPIO2: icewerks (U1.PL3_21), peripherals (J1.9 R48.2)
FPGA_GPIO3: icewerks (U1.PL3_23), peripherals (J1.10 R50.2)
FPGA_GPIO4: icewerks (U1.PL3_25), peripherals (J1.11 R59.2)
FPGA_GPIO5: icewerks (U1.PL3_27), peripherals (J1.12 R64.2)
FPGA_GPIO6: icewerks (U1.PL3_29), peripherals (J1.13 R66.2)
FPGA_GPIO7: icewerks (U1.PL3_31), peripherals (J1.14 R68.2)
FPGA_GPIO8: icewerks (U1.PL3_33), peripherals (J1.15 R70.2)
FPGA_GPIO9: icewerks (U1.PL3_35), peripherals (C13.2 J1.16 SW3.1 SW3.2)
IOEXP_CSn: icewerks (U1.PL3_15), peripherals (R55.2 R58.2)
MISO: icewerks (U1.PL2_30), peripherals (J2.5 R56.2)
MOSI: icewerks (U1.PL2_28), peripherals (J2.6 R57.2)
RESETn: icewerks (7 pins), peripherals (R63.2)
SCK: icewerks (U1.PL2_32), peripherals (J2.4 R52.2)
SCL: icewerks (U1.PL3_11), peripherals (5 pins)
SDA: icewerks (U1.PL3_13), peripherals (5 pins)
UART_RX: icewerks (U1.PL3_3), peripherals (J2.1)
UART_TX: icewerks (U1.PL3_5), peripherals (J2.2)

## Assembly variants
PRODUCTION: not fitted R34 R35 R36 R72 R73 R74 R79 R? R?